# EAGLE design daughter-pots1.1 (EAGLE 6.6.0)
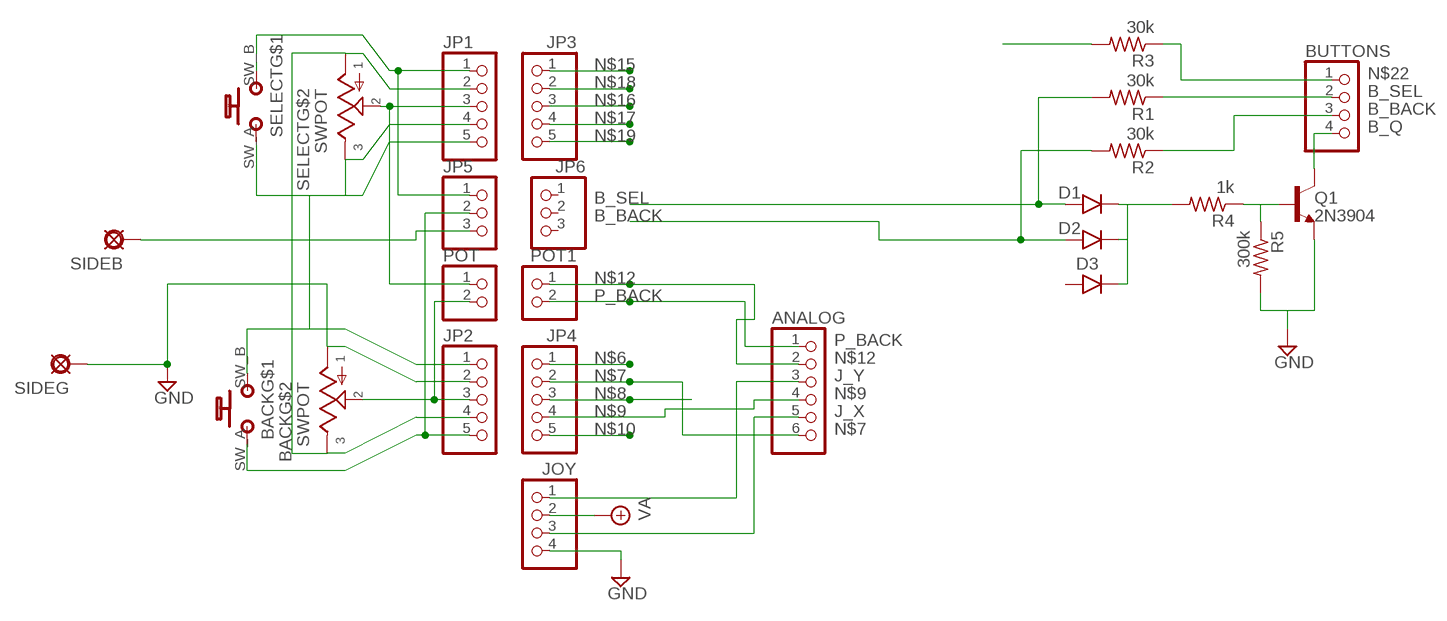
[diagram p0: schematic, sheet 1]

## Parts
ANALOG  PINHD-1X6  [1X06]
BACK  SWPOT  [SWPOT]
BUTTONS  PINHD-1X4  [1X04]
D1  1N4148-3  [DO35-3]
D2  1N4148-2  [DO35-2]
D3  1N4148-4  [DO35-4]
JOY  PINHD-1X4  [1X04]
JP1  PINHD-1X5  [1X05]
JP2  PINHD-1X5  [1X05]
JP3  PINHD-1X5  [1X05]
JP4  PINHD-1X5  [1X05]
JP5  PINHD-1X3  [1X03]
JP6  PINHD-1X3  [1X03]
POT  PINHD-1X2  [1X02]
POT1  PINHD-1X2  [1X02]
Q1  2N3904  [TO92-]
R1  30k  6MM.3  [R0207/3]
R2  30k  6MM.3  [R0207/3]
R3  30k  6MM.3  [R0207/3]
R4  1k  6MM.3  [R0207/3]
R5  300k  6MM.1  [R0207/1V]
SELECT  SWPOT  [SWPOT]
SIDEB  PAD  [SQUARE]
SIDEG  PAD  [SQUARE]

## Nets
B_BACK: D2.A R2.2
B_Q: BUTTONS.4 Q1.1(C)
B_SEL: D1.A R1.2
GND: BACK.POT_B BACK.SW_B(B_B) JOY.4 JP1.4 JP1.5 JP2.1 JP2.2 Q1.3(E) R5.2 SELECT.POT_A SELECT.SW_A(B_A) SIDEG.1(PAD)
J_X: ANALOG.5 JOY.3
J_Y: ANALOG.3 JOY.1
N$1: Q1.2(B) R4.1 R5.1
N$2: BUTTONS.2 R1.1
N$3: BUTTONS.3 R2.1
N$4: D1.C D2.C D3.C R4.2
N$5: BUTTONS.1 R3.1
N$6: JP4.1
N$7: ANALOG.6 JP4.2
N$8: JP4.3
N$9: ANALOG.4 JP4.4
N$10: JP4.5
N$11: BACK.POT_W JP2.3 POT.2
N$12: ANALOG.2 POT1.1
N$13: JP1.1 JP5.1 SELECT.SW_B(B_B)
N$14: BACK.SW_A(B_A) JP2.5 JP5.2
N$15: JP3.1
N$16: JP3.3
N$17: JP3.4
N$18: JP3.2
N$19: JP3.5
N$20: BACK.POT_A JP1.2 JP2.4 SELECT.POT_B
N$22: R3.2
N$24: JP5.3 SIDEB.1(PAD)
P_BACK: ANALOG.1 POT1.2
P_SEL: JP1.3 POT.1 SELECT.POT_W
VA: JOY.2
Unconnected: D3.A JP6.1 JP6.2 JP6.3

## Library data of the parts
ANALOG = pinhead:PINHD-1X6: PIN HEADER
BACK SELECT = jaapie:SWPOT
BUTTONS JOY = pinhead:PINHD-1X4: PIN HEADER
D1-D3 = gm-diodes:1N4148: Fast Switching Diode DO-35 glass case a.k.a. 1N914
JP1-JP4 = pinhead:PINHD-1X5: PIN HEADER
JP5 JP6 = pinhead:PINHD-1X3: PIN HEADER
POT POT1 = pinhead:PINHD-1X2: PIN HEADER
Q1 = gm-trans:2N3904: NPN Transistor
R1-R5 = gm-resistors:6MM: 6mm Resistors Leads spaced 1-6 holes apart for 0.1" perfboard. Suitable for 1/4 watt resistors.
SIDEB SIDEG = gm-supply:PAD: PAD use this package for pads with any purpose, including input, output, send or return various pad shapes: round, square, octogonal, long, and long offset

## Board
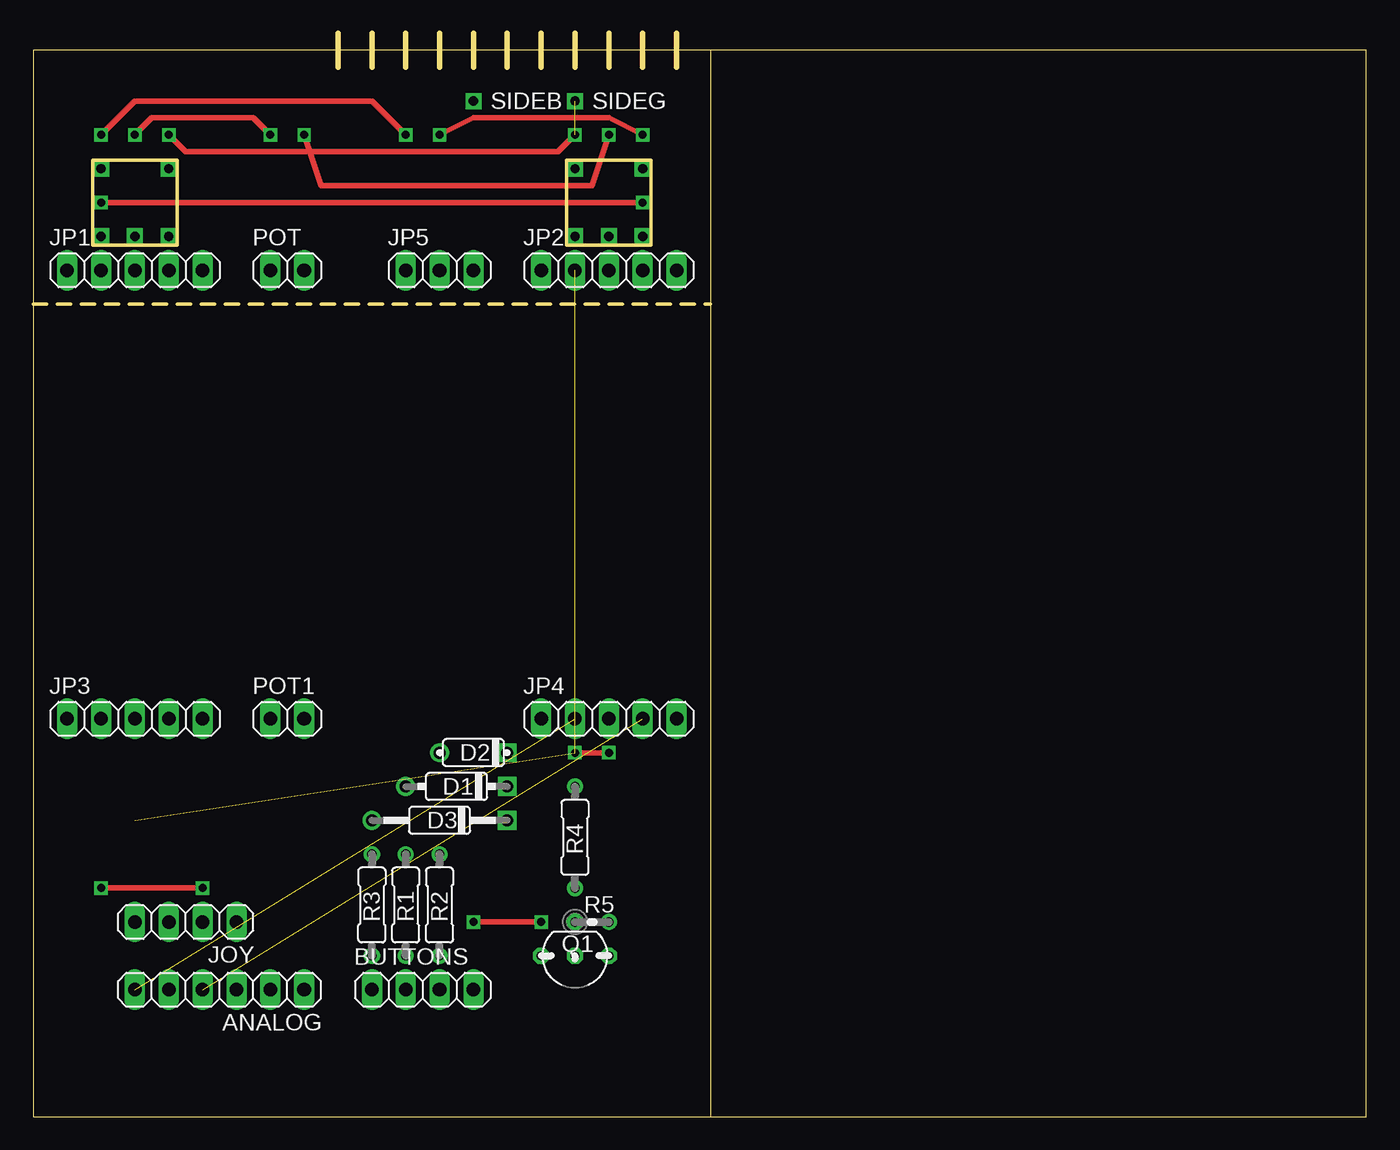
[diagram p1: board, top side]
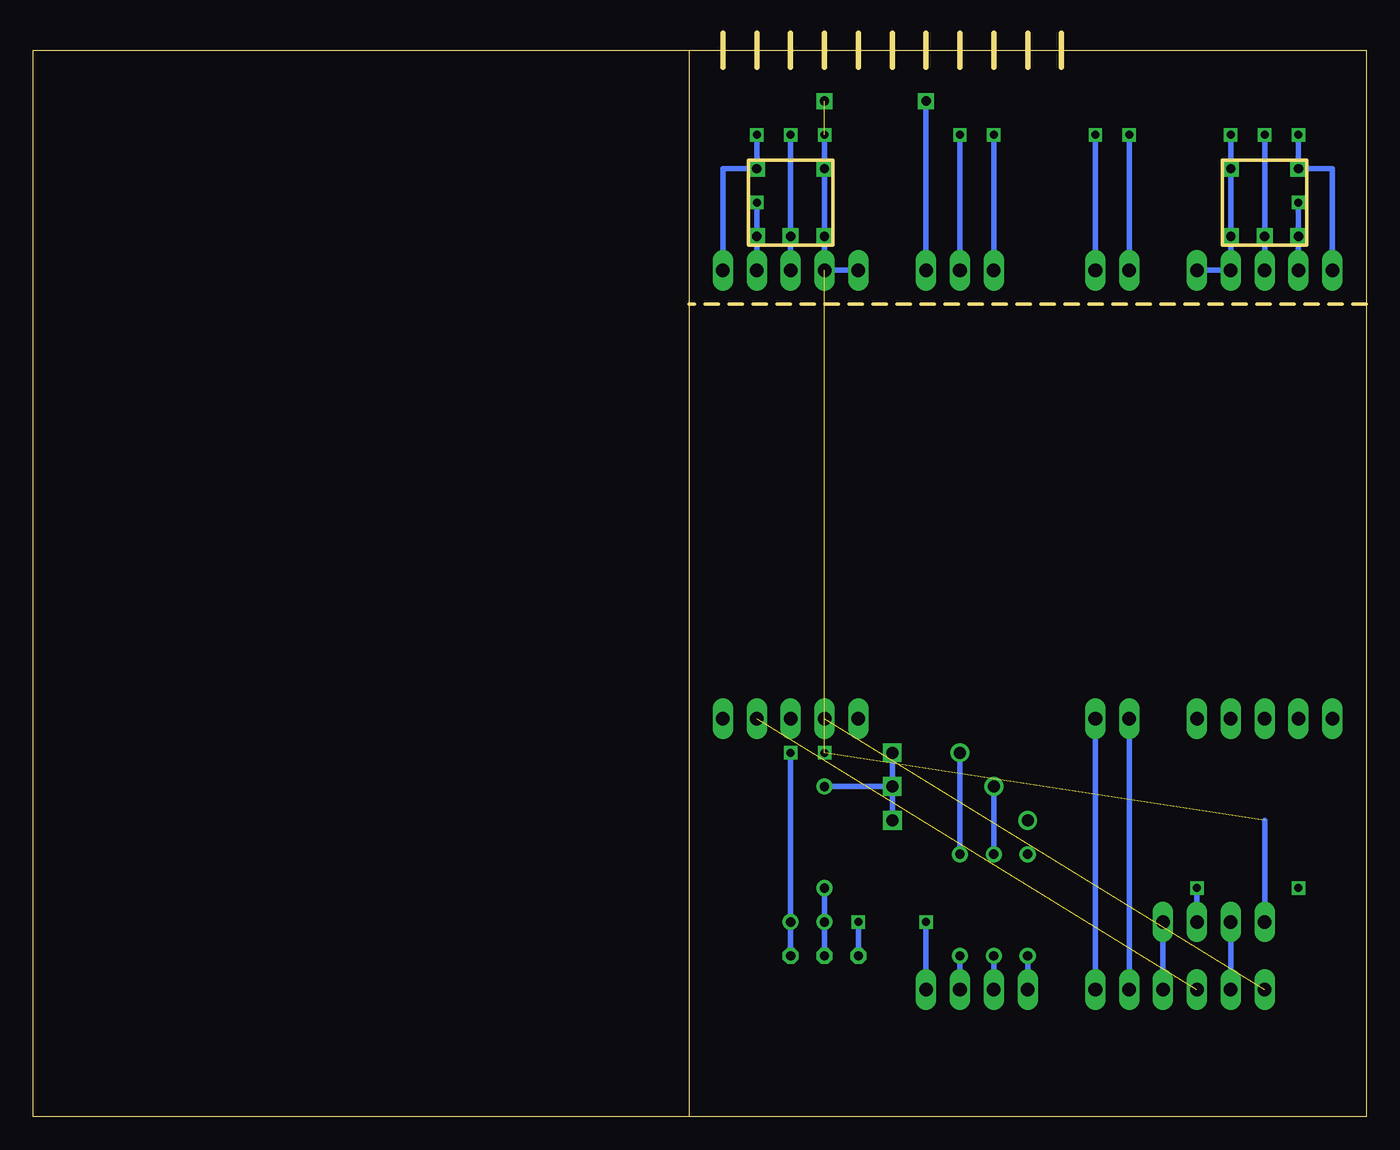
[diagram p2: board, bottom side, seen from below]

Size 100 x 81.28 mm. Coordinates in mm from the lower left corner, seen from the top.
Outline: 50.8,0 0,0 0,60.96
Outline: 50.8,0 100,0 100,80 0,80 0,60.96
Outline: 25.4,81.28 25.4,78.74
Outline: 27.94,81.28 27.94,78.74
Outline: 22.86,81.28 22.86,78.74
Outline: 33.02,81.28 33.02,78.74
Outline: 38.1,81.28 38.1,78.74
Outline: 30.48,81.28 30.48,78.74
Outline: 35.56,81.28 35.56,78.74
Outline: 45.72,81.28 45.72,78.74
Outline: 43.18,78.74 43.18,81.28
Outline: 40.64,78.74 40.64,81.28
Outline: 48.26,81.28 48.26,78.74
Outline: 50.8,80.01 50.8,60.96
Outline: 50.8,60.96 50.8,0
Outline: 0,60.96 50.8,60.96
Outline: 4.45,71.75 4.45,65.41 10.79,65.41 10.79,71.75 4.45,71.75
Outline: 40.01,71.75 40.01,65.41 46.35,65.41 46.35,71.75 40.01,71.75
Copper layers (1*16): Top 0.035mm / dielectric 1.5mm / Bottom 0.035mm
Design rules "default": minimum track width 10mil, minimum drill 24mil, track to track 8mil, track to pad 8mil, pad to pad 8mil, via to via 8mil, smd to smd 8mil, copper to edge 40mil, drill to drill 8mil, minimum pad ring 10mil, minimum via ring 8mil, stop-mask expansion 4mil, vias tented up to drill 0mil, thermal gap 10mil

### Footprints (pad centres in the part's own frame; a part is rotated, then mirrored left to right if it is on the bottom)
1X06 = drill 1.016 long: 1 -6.35,0; 2 -3.81,0; 3 -1.27,0; 4 1.27,0; 5 3.81,0; 6 6.35,0
SWPOT = drill 0.7 square: POT_A -2.54,0; POT_B 2.54,0; POT_W 0,0; SW_A -2.54,-5.08; SW_B 2.54,-5.08
1X04 = drill 1.016 long: 1 -3.81,0; 2 -1.27,0; 3 1.27,0; 4 3.81,0
DO35-3 = drill 0.9: A 3.81,0 | drill 0.9 square: C -3.81,0
DO35-2 = drill 0.9: A 2.54,0 | drill 0.9 square: C -2.54,0
DO35-4 = drill 0.9 pad 1.422: A 5.08,0 | drill 0.9 pad 1.422 square: C -5.08,0
1X05 = drill 1.016 long: 1 -5.08,0; 2 -2.54,0; 3 0,0; 4 2.54,0; 5 5.08,0
1X03 = drill 1.016 long: 1 -2.54,0; 2 0,0; 3 2.54,0
1X02 = drill 1.016 long: 1 -1.27,0; 2 1.27,0
TO92- = drill 0.7 octagon: 1 2.54,0; 2 0,0; 3 -2.54,0
R0207/3 = drill 0.7: 1 -3.81,0; 2 3.81,0
R0207/1V = drill 0.7: 1 -1.27,0; 2 1.27,0
SQUARE = drill 0.7 square: 1 0,0

### Placement (x,y rotation side)
ANALOG  13.97,9.53 180 top
BACK  43.18,66.04 180 top
BUTTONS  29.21,9.53 0 top
D1  31.75,24.77 180 top
D2  33.02,27.3 180 top
D3  30.48,22.23 180 top
JOY  11.43,14.61 180 top
JP1  7.62,63.5 0 top
JP2  43.18,63.5 0 top
JP3  7.62,29.84 0 top
JP4  43.18,29.84 0 top
JP5  30.48,63.5 0 top
JP6  5.08,-10.16 0 top  (outside the outline)
POT  19.05,63.5 0 top
POT1  19.05,29.84 0 top
Q1  40.64,12.06 180 top
R1  27.94,15.88 90 top
R2  30.48,15.88 90 top
R3  25.4,15.88 90 top
R4  40.64,20.95 90 top
R5  41.91,14.61 0 top
SELECT  7.62,66.04 180 top
SIDEB  33.02,76.2 0 top
SIDEG  40.64,76.2 0 top

### Tracks (layer width: path | path; a pad name or v marks a point on that pad's centre or on a via)
B_BACK
  Bottom 0.406: D2.A R2.2
B_Q  (via drill 0.6)
  Top 0.406: v33.02,14.61 v38.1,14.61
  Bottom 0.406: BUTTONS.4 v33.02,14.61 | v38.1,14.61 Q1.1
B_SEL
  Bottom 0.406: D1.A R1.2
GND  (via drill 0.6)  (3 unrouted)
  Top 0.406: v40.64,27.3 v43.18,27.3 | v10.16,73.66 11.43,72.39 39.37,72.39 v40.64,73.66
  Bottom 0.406: Q1.3 R5.2 v43.18,27.3 | 7.62,22.23 JOY.4 | JP1.4 SELECT.POT_A SELECT.SW_A | SELECT.SW_A v10.16,73.66 | JP1.5 JP1.4 | JP1.4 SELECT.SW_A | v40.64,73.66 BACK.SW_B BACK.POT_B JP2.2 JP2.1
J_X
  Bottom 0.406: JOY.3 ANALOG.5
J_Y
  Bottom 0.406: JOY.1 ANALOG.3
N$1
  Bottom 0.406: Q1.2 R5.1 R4.1
N$2
  Bottom 0.406: R1.1 BUTTONS.2
N$3
  Bottom 0.406: R2.1 BUTTONS.3
N$4
  Bottom 0.406: D3.C D1.C | D1.C D2.C | R4.2 D1.C
N$5
  Bottom 0.406: BUTTONS.1 R3.1
N$7  (1 unrouted)
N$9  (1 unrouted)
N$11  (via drill 0.6)
  Top 0.406: v20.32,73.66 21.59,69.85 41.91,69.85 v43.18,73.66
  Bottom 0.406: JP2.3 BACK.POT_W v43.18,73.66 | POT.2 v20.32,73.66
N$12
  Bottom 0.406: ANALOG.2 POT1.1
N$13  (via drill 0.6)
  Top 0.406: v5.08,73.66 7.62,76.2 25.4,76.2 v27.94,73.66
  Bottom 0.406: JP1.1 2.54,71.12 SELECT.SW_B v5.08,73.66 | v27.94,73.66 JP5.1
N$14  (via drill 0.6)
  Top 0.406: v30.48,73.66 33.02,74.93 43.18,74.93 v45.72,73.66
  Bottom 0.406: JP2.5 48.26,71.12 BACK.SW_A v45.72,73.66 | JP5.2 v30.48,73.66
N$17
  Bottom 0.406: JP3.4 10.16,29.21
N$20  (via drill 0.6)
  Top 0.406: v45.72,68.58 v5.08,68.58
  Bottom 0.406: JP1.2 SELECT.POT_B v5.08,68.58 | JP2.4 BACK.POT_A v45.72,68.58
N$24
  Bottom 0.406: SIDEB.1 JP5.3
P_BACK
  Bottom 0.406: POT1.2 ANALOG.1
P_SEL  (via drill 0.6)
  Top 0.406: v7.62,73.66 8.89,74.93 16.51,74.93 v17.78,73.66
  Bottom 0.406: SELECT.POT_W JP1.3 v7.62,73.66 | v17.78,73.66 POT.1
VA  (via drill 0.6)
  Top 0.406: v5.08,17.14 v12.7,17.14
  Bottom 0.406: v12.7,17.14 JOY.2